# Altium schematic sheet PushButton.SchDoc
size A4; SheetNumber: 3; SheetTotal: 14
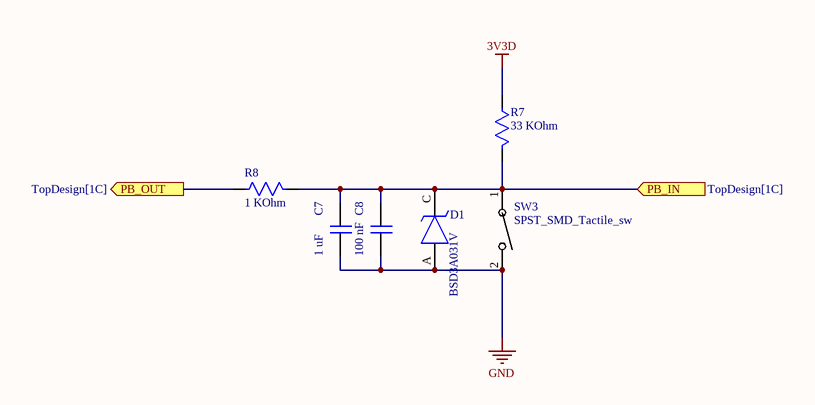
[diagram p0: PushButton.SchDoc]

## Parts
C7  1 uF  [CAP_0603]
C8  100 nF  [CAP_0603]
D1  BSD3A031V  [MCC_SOD-323_IPC_A]
R7  33 KOhm  [Res_0603]
R8  1 KOhm  [Res_0603]
SW3  SPST_SMD_Tactile_sw  [SPST_SMD_6mm]

## Ports
PB_IN (in, see TopDesign[1C]), PB_OUT (out, see TopDesign[1C])

## Nets
3V3D: R7.2
GND: C7.1 C8.1 D1.A SW3.2
PB_IN: C7.2 C8.2 D1.C R7.1 R8.1 SW3.1 ; port PB_IN
PB_OUT: R8.2 ; port PB_OUT

## Library data of the parts
C7 C8 = Cap SMD: Cap SMD.
D1 = TVS_Diode_Single: TVS Diode (Uni-directional); Manufacturer_Name: LITTELFUSE; Manufacturer_Part_Number: SMAJ14A; Datasheet Link: https://componentsearchengine.com/Datasheets/2/SMAJ14A.pdf; Height: 2.29mm; Mouser Part Number: 576-SMAJ14A; Mouser Price/Stock: https://www.mouser.co.uk/ProductDetail/Littelfuse/SMAJ14A?qs=HR2RnyOI4E4Xmn1pka9YNw%3D%3D; Arrow Part Number: SMAJ14A; Arrow Price/Stock: https://www.arrow.com/en/products/smaj14a/littelfuse?region=nac
R7 R8 = Res smd: SMD Resistor; MP: RC0805FR-07330RL; MF: Yageo; Package: 2012 Rohm Semiconductor; Value: *; SnapEDA_Link: https://www.snapeda.com/parts/RC0805FR-07330RL/Yageo/view-part/106115/?ref=snap; Price: None; Availability: Unavailable
SW3 = SPST_SMD_Tactile_sw: SPST SMD Tactile Switches Rectangle button Brick nogging; Mfr_Name: XKB Connectivity